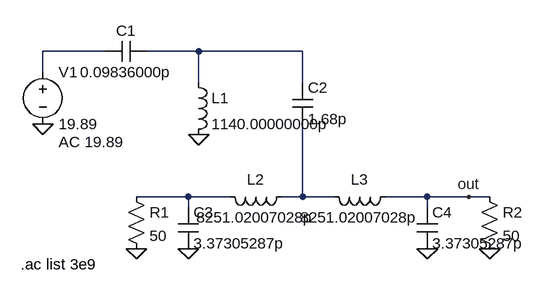
[diagram p0: schematic monopole-equivalent-circuit.asc]
monopole-equivalent-circuit.asc, the LTspice schematic file:
Version 4
SHEET 1 880 680
WIRE 144 48 48 48
WIRE 288 48 208 48
WIRE 448 48 288 48
WIRE 48 80 48 48
WIRE 288 96 288 48
WIRE 448 96 448 48
WIRE 272 272 192 272
WIRE 336 272 272 272
WIRE 448 272 448 160
WIRE 448 272 416 272
WIRE 496 272 448 272
WIRE 640 272 576 272
WIRE 704 272 640 272
WIRE 736 272 704 272
WIRE 272 288 272 272
WIRE 640 288 640 272
FLAG 640 352 0
FLAG 736 352 0
FLAG 272 352 0
FLAG 192 352 0
FLAG 288 176 0
FLAG 48 160 0
FLAG 704 272 out
SYMBOL voltage 48 64 R0
WINDOW 123 24 124 Left 2
WINDOW 39 0 0 Left 0
SYMATTR InstName V1
SYMATTR Value 19.89
SYMATTR Value2 AC 19.89
SYMBOL cap 208 32 R90
WINDOW 0 0 32 VBottom 2
WINDOW 3 32 32 VTop 2
SYMATTR InstName C1
SYMATTR Value 0.09836000p
SYMBOL ind 272 80 R0
SYMATTR InstName L1
SYMATTR Value 1140.00000000p
SYMBOL cap 432 96 R0
SYMATTR InstName C2
SYMATTR Value 1.68p
SYMBOL ind 432 256 R90
WINDOW 0 5 56 VBottom 2
WINDOW 3 32 56 VTop 2
SYMATTR InstName L2
SYMATTR Value 8251.02007028p
SYMBOL ind 592 256 R90
WINDOW 0 5 56 VBottom 2
WINDOW 3 32 56 VTop 2
SYMATTR InstName L3
SYMATTR Value 8251.02007028p
SYMBOL cap 256 288 R0
SYMATTR InstName C3
SYMATTR Value 3.37305287p
SYMBOL cap 624 288 R0
SYMATTR InstName C4
SYMATTR Value 3.37305287p
SYMBOL res 176 256 R0
SYMATTR InstName R1
SYMATTR Value 50
SYMBOL res 720 256 R0
SYMATTR InstName R2
SYMATTR Value 50
TEXT 14 376 Left 2 !.ac list 3e9

The netlist it stands for:
* monopole-equivalent-circuit.asc
V1 N001 0 19.89 AC 19.89
C1 N002 N001 0.09836000p
L1 N002 0 1140.00000000p
C2 N002 N004 1.68p
L2 N004 N003 8251.02007028p
L3 out N004 8251.02007028p
C3 N003 0 3.37305287p
C4 out 0 3.37305287p
R1 N003 0 50
R2 out 0 50
.ac list 3e9
.backanno
.end